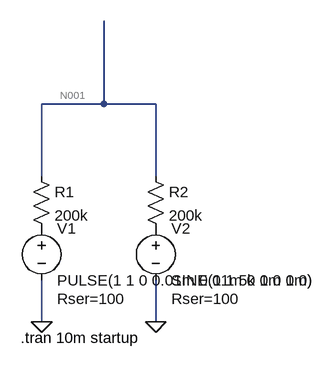
[diagram p0: schematic summ_dev.asc]
summ_dev.asc, the LTspice schematic file:
Version 4
SHEET 1 880 680
WIRE 144 -144 144 -272
WIRE 144 -144 48 -144
WIRE 224 -144 144 -144
WIRE 48 -32 48 -144
WIRE 224 -32 224 -144
WIRE 48 192 48 128
WIRE 224 192 224 128
FLAG 48 192 0
FLAG 224 192 0
SYMBOL res 32 -48 R0
SYMATTR InstName R1
SYMATTR Value 200k
SYMATTR SpiceLine tol=5 pwr=0.125
SYMBOL res 208 -48 R0
SYMATTR InstName R2
SYMATTR Value 200k
SYMATTR SpiceLine tol=5 pwr=0.125
SYMBOL voltage 48 32 R0
WINDOW 123 0 0 Left 2
WINDOW 39 24 124 Left 2
SYMATTR SpiceLine Rser=100
SYMATTR InstName V1
SYMATTR Value PULSE(1 1 0 0.01m 0.01m 0 1m 1m)
SYMBOL voltage 224 32 R0
WINDOW 123 0 0 Left 2
WINDOW 39 24 124 Left 2
SYMATTR SpiceLine Rser=100
SYMATTR InstName V2
SYMATTR Value SINE(1 1 5k 0 0 0 0)
TEXT 16 216 Left 2 !.tran 10m startup

The netlist it stands for:
* summ_dev.asc
R1 N001 P001 200k tol=5 pwr=0.125
R2 N001 P002 200k tol=5 pwr=0.125
V1 P001 0 PULSE(1 1 0 0.01m 0.01m 0 1m 1m) Rser=100
V2 P002 0 SINE(1 1 5k 0 0 0 0) Rser=100
.tran 10m startup
.backanno
.end

* Results of the author's LTspice run, read from the files saved beside the schematic
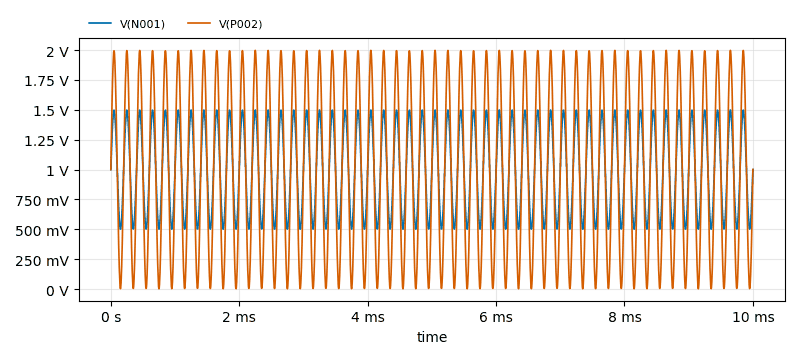
[diagram p1: Transient Analysis of summ_dev.asc, plotted from the saved traces]
* Transient Analysis, 1 run:
*   V(N001): min 501.2 mV, max 1.499 V, average 1 V, rms 1.059 V, last 1 V
*   V(P002): min 2.635 mV, max 1.997 V, average 1 V, rms 1.22 V, last 1 V